# Altium schematic sheet Sheet2.SchDoc
size A4; SheetNumber: 1; SheetTotal: 1; SPICEModelCacheXTZEHGPZ: <root> / <DocumentId>XTZEHGPZ</DocumentId> / <CacheFrame Number="0"> / <Model Name="1016_7447221101_100u" Kind="CKT"> / <Text>******* / .subckt 1016_7447221101_100u 1 2 / Rp 1 2 90000 / Cp 1 2 14.22p / Rs 1 N3 0.085 / L1 N3 2 100u / .ends 1016_7447221101_100u</Text> / </Model> / </CacheFrame> / </root>
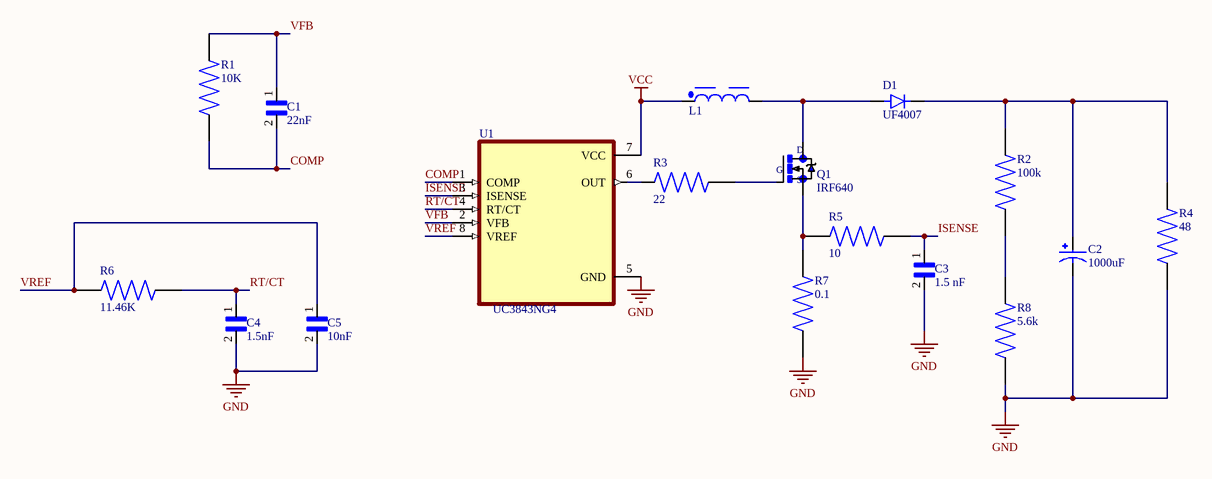
[diagram p0: Sheet2.SchDoc]

## Parts
C1  22nF  [CAP_RDER71H223K0M1H03A]
C2  1000uF  [CAPPRD500W60D1000H1600]
C3  1.5 nF  [CAP TH ALPOLY D8.00mm S3.50mm H21.50mm]
C4  1.5nF  [CAPRR750W60L1000T450H1000]
C5  10nF  [CAP_RDER71H103K0K1H03B]
D1  UF4007  [DIOAD1036W78L470D235]
L1  100uH, 2.45A  [WE-TI_1016]  (value not drawn)
Q1  IRF640  [*TO220V]
R1  10K  [RESAD1100W55L680D260]
R2  100k  [RESAD1100W55L680D260]
R3  22  [RESAD1100W55L680D260]
R4  48  [RESAD1100W55L680D260]
R5  10  [RESAD1100W55L680D260]
R6  11.46K  [RESAD1100W55L680D260]
R7  0.1  [RESAD1100W55L680D260]
R8  5.6k  [RESAD1100W55L680D260]
U1  UC3843NG4  [DIP794W45P254L959H508Q8]

## Nets
GND: C2.N C3.2 C4.2 C5.2 R4.1 R7.1 R8.1 U1.5(GND)
VCC: L1.1 U1.7(VCC)
COMP: C1.2 R1.1 U1.1(COMP)
ISENSE: C3.1 R5.1 U1.3(ISENSE)
RT/CT: C4.1 R6.2 U1.4(RT/CT)
VFB: C1.1 R1.2 U1.2(VFB)
VREF: C5.1 R6.1 U1.8(VREF)
NetC2_P: C2.P D1.C(K) R2.2 R4.2
NetD1_A: D1.A L1.2 Q1.2(D)
NetQ1_1: Q1.1(G) R3.1
NetQ1_3: Q1.3(S) R5.2 R7.2
NetR2_1: R2.1 R8.2
NetR3_2: R3.2 U1.6(OUT)

## Library data of the parts
C1 = RDER71H223K0M1H03A: Cap Ceramic 1pF 50V C0G 0.25pF Radial 5mm 125C Ammo; Package: None; Price: None; Value: *; MP: RDER71H223K0M1H03A; Availability: Unavailable
C2 = EEUFK1C102B: CAP ALUM 1000UF 20% 16V RAD TH; MF: Panasonic; SnapEDA_Link: https://www.snapeda.com/parts/EEUFK1C102B/Panasonic/view-part/5795499/?ref=snap; Price: None; Availability: Not in stock; Value: *; Check_prices: https://www.snapeda.com/parts/EEUFK1C102B/Panasonic/view-part/5795499/?ref=eda; MP: EEUFK1C102B; Package: RADIAL-2 Panasonic
C3 C5 = RDER71H103K0K1H03B: Lead Capacitor X7R_EIA_ with Capacitance: 10000pF and Rated Voltage: 50Vdc; MF: Murata; MP: RDER71H103K0K1H03B; SnapEDA_Link: https://www.snapeda.com/parts/RDER71H103K0K1H03B/Murata/view-part/4545040/?ref=snap; Value: *; Package: Radial Murata; Price: None; Availability: Unavailable
C4 = ECQE6152KF: MP: ECQE6152KF; Value: *; Package: None; Availability: Unavailable; Price: None
D1 = UF4007: 75ns, 1A, 1000V, High Efficient Recovery Rectifier; MF: Taiwan Semiconductor; SnapEDA_Link: https://www.snapeda.com/parts/UF4007/taiwan/view-part/?ref=snap; Package: DO-41-2 Taiwan Semiconductor; Value: *; MP: UF4007; Check_prices: https://www.snapeda.com/parts/UF4007/taiwan/view-part/?ref=eda
L1 = 7447221101: WE-TI Radial Leaded Wire Wound Inductor, size 1016, 100uH, 2.45A, 0.1Ohm; Manufacturer: Wurth Elektronik; Case/Size Code: 1016; Saturation Current @ 10%: 2.75A; Self Resonant Frequency: 4MHz; Manufacturer Part Number: 7447221101; Category: Power Inductors; Match Code: WE-TI; ComponentLink1Description: Website Link; ComponentLink1URL: https://www.we-online.com/redexpert/article/7447221101?ad; ComponentLink2Description: Datasheet Link; ComponentLink2URL: https://www.we-online.com/redexpert/spec/7447221101?ad; Mount: Through Hole; Operating Temperature Max: 125°C; Operating Temperature Min: -40°C; Packaging: Tray; Height: 17mm; Diameter: 11mm; DC Resistance Max: 0.1Ohm; Inductance: 100uH; Rated Current: 2.45A
Q1 = IRF640: Single-Gate MOSFET Transistors 200V Single N-Channel HEXFET; MF: STMicroelectronics; SnapEDA_Link: https://www.snapeda.com/parts/IRF640/STMicroelectronics/view-part/?ref=snap; Package: TO-220 STMicroelectronics; MP: IRF640; Check_prices: https://www.snapeda.com/parts/IRF640/STMicroelectronics/view-part/?ref=eda; Value: *
R1-R8 = MFR-25FBF52-1K: 1.07 kOhms Â±1% 0.25W, 1/4W Through Hole Resistor Axial - Metal Film; MF: Yageo; SnapEDA_Link: https://www.snapeda.com/parts/MFR-25FBF52-1K/Yageo/view-part/?ref=snap; Package: RADIAL-2 YAGEO; Value: *; MP: MFR-25FBF52-1K; Check_prices: https://www.snapeda.com/parts/MFR-25FBF52-1K/Yageo/view-part/?ref=eda
U1 = UC3843NG4: Single ended 500KHz current mode PWM controller with 8.4V/7.6V UVLO 100% duty cycle, 0C to 70C 8-PDIP 0 to 70; MF: Texas Instruments; SnapEDA_Link: https://www.snapeda.com/parts/UC3843NG4/Texas+Instruments/view-part/?ref=snap; Package: PDIP-8 Texas; Value: *; MP: UC3843NG4; Check_prices: https://www.snapeda.com/parts/UC3843NG4/Texas+Instruments/view-part/?ref=eda